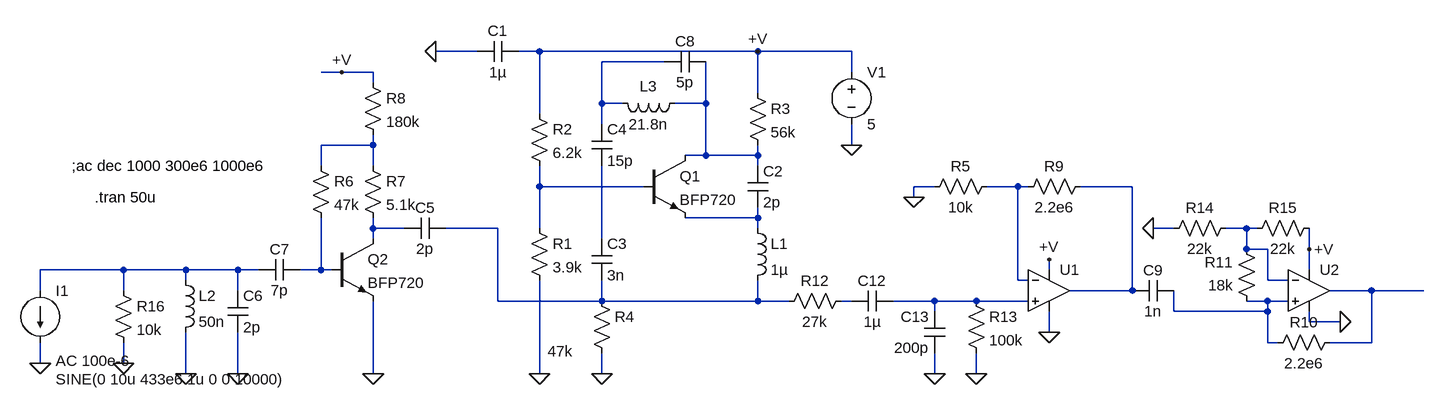
[diagram p0: schematic xy-mk-5v.asc]
xy-mk-5v.asc, the LTspice schematic file:
Version 4
SHEET 1 880 680
WIRE -832 -176 -896 -176
WIRE -736 -176 -768 -176
WIRE -400 -176 -736 -176
WIRE -256 -176 -400 -176
WIRE -544 -160 -640 -160
WIRE -1040 -144 -1072 -144
WIRE -992 -144 -1040 -144
WIRE -256 -144 -256 -176
WIRE -992 -128 -992 -144
WIRE -400 -112 -400 -176
WIRE -640 -96 -640 -160
WIRE -608 -96 -640 -96
WIRE -480 -96 -480 -160
WIRE -480 -96 -528 -96
WIRE -736 -80 -736 -176
WIRE -640 -64 -640 -96
WIRE -992 -32 -992 -48
WIRE -992 -32 -1072 -32
WIRE -256 -32 -256 -64
WIRE -480 -16 -480 -96
WIRE -480 -16 -512 -16
WIRE -400 -16 -400 -32
WIRE -400 -16 -480 -16
WIRE -1072 0 -1072 -32
WIRE -992 0 -992 -32
WIRE -400 0 -400 -16
WIRE -736 32 -736 0
WIRE -576 32 -736 32
WIRE -128 32 -160 32
WIRE 0 32 -48 32
WIRE 16 32 0 32
WIRE 176 32 96 32
WIRE -160 48 -160 32
WIRE -400 80 -400 64
WIRE -400 80 -512 80
WIRE -992 96 -992 80
WIRE -944 96 -992 96
WIRE -800 96 -880 96
WIRE -736 96 -736 32
WIRE -400 96 -400 80
WIRE 240 96 208 96
WIRE 352 96 320 96
WIRE 368 96 352 96
WIRE -992 112 -992 96
WIRE -640 112 -640 0
WIRE 352 128 352 96
WIRE 384 128 352 128
WIRE 448 128 448 96
WIRE -1376 160 -1504 160
WIRE -1280 160 -1376 160
WIRE -1200 160 -1280 160
WIRE -1168 160 -1200 160
WIRE -1072 160 -1072 80
WIRE -1072 160 -1104 160
WIRE -1056 160 -1072 160
WIRE 48 160 48 144
WIRE 448 160 448 128
WIRE -1280 176 -1280 160
WIRE 0 176 0 32
WIRE 16 176 0 176
WIRE 384 176 384 128
WIRE 416 176 384 176
WIRE -1504 192 -1504 160
WIRE -1376 192 -1376 160
WIRE -1200 192 -1200 160
WIRE 176 192 176 32
WIRE 176 192 80 192
WIRE 544 192 480 192
WIRE 624 192 544 192
WIRE -800 208 -800 96
WIRE -640 208 -640 176
WIRE -640 208 -800 208
WIRE -400 208 -400 176
WIRE -400 208 -640 208
WIRE -352 208 -400 208
WIRE -256 208 -272 208
WIRE -128 208 -192 208
WIRE -64 208 -128 208
WIRE 16 208 -64 208
WIRE 384 208 352 208
WIRE 416 208 384 208
WIRE -128 224 -128 208
WIRE 240 224 240 192
WIRE 384 224 384 208
WIRE 384 224 240 224
WIRE 448 240 448 224
WIRE 496 240 448 240
WIRE 48 256 48 224
WIRE 384 272 384 224
WIRE 400 272 384 272
WIRE 544 272 544 192
WIRE 544 272 480 272
WIRE -1504 304 -1504 272
WIRE -1376 304 -1376 272
WIRE -1280 320 -1280 256
WIRE -1200 320 -1200 256
WIRE -992 320 -992 208
WIRE -736 320 -736 176
WIRE -640 320 -640 288
WIRE -128 320 -128 288
WIRE -64 320 -64 288
FLAG -736 320 0
FLAG -400 -176 +V
FLAG -640 320 0
FLAG -256 -32 0
FLAG -1504 304 0
FLAG -992 320 0
FLAG -1200 320 0
FLAG -1280 320 0
FLAG -1040 -144 +V
FLAG -896 -176 0
FLAG -128 320 0
FLAG -64 320 0
FLAG -160 48 0
FLAG 48 256 0
FLAG 48 144 +V
FLAG 208 96 0
FLAG 496 240 0
FLAG 448 128 +V
FLAG -1376 304 0
SYMBOL npn -576 -16 R0
SYMATTR InstName Q1
SYMATTR Value BFP720
SYMBOL res -752 80 R0
SYMATTR InstName R1
SYMATTR Value 3.9k
SYMBOL res -752 -96 R0
SYMATTR InstName R2
SYMATTR Value 6.2k
SYMBOL cap -768 -192 R90
WINDOW 0 0 32 VBottom 2
WINDOW 3 32 32 VTop 2
SYMATTR InstName C1
SYMATTR Value 1µ
SYMBOL res -416 -128 R0
SYMATTR InstName R3
SYMATTR Value 56k
SYMBOL cap -416 0 R0
SYMATTR InstName C2
SYMATTR Value 2p
SYMBOL ind -416 80 R0
SYMATTR InstName L1
SYMATTR Value 1µ
SYMBOL res -656 192 R0
WINDOW 3 -67 93 Left 2
SYMATTR InstName R4
SYMATTR Value 47k
SYMBOL voltage -256 -160 R0
WINDOW 123 0 0 Left 2
WINDOW 39 0 0 Left 2
SYMATTR InstName V1
SYMATTR Value 5
SYMBOL current -1504 192 R0
WINDOW 3 24 136 Left 2
WINDOW 123 24 108 Left 2
WINDOW 39 0 0 Left 2
SYMATTR InstName I1
SYMATTR Value SINE(0 10u 433e6 1u 0 0 10000)
SYMATTR Value2 AC 100e-6
SYMBOL cap -880 80 R90
WINDOW 0 0 32 VBottom 2
WINDOW 3 32 32 VTop 2
SYMATTR InstName C5
SYMATTR Value 2p
SYMBOL cap -656 112 R0
SYMATTR InstName C3
SYMATTR Value 3n
SYMBOL ind -1296 160 R0
SYMATTR InstName L2
SYMATTR Value 50n
SYMBOL cap -1216 192 R0
SYMATTR InstName C6
SYMATTR Value 2p
SYMBOL cap -1104 144 R90
WINDOW 0 0 32 VBottom 2
WINDOW 3 32 32 VTop 2
SYMATTR InstName C7
SYMATTR Value 7p
SYMBOL npn -1056 112 R0
SYMATTR InstName Q2
SYMATTR Value BFP720
SYMBOL res -1088 -16 R0
SYMATTR InstName R6
SYMATTR Value 47k
SYMBOL res -1008 -16 R0
SYMATTR InstName R7
SYMATTR Value 5.1k
SYMBOL res -1008 -144 R0
SYMATTR InstName R8
SYMATTR Value 180k
SYMBOL ind -512 -112 R90
WINDOW 0 5 56 VBottom 2
WINDOW 3 32 56 VTop 2
SYMATTR InstName L3
SYMATTR Value 21.8n
SYMBOL cap -656 -64 R0
SYMATTR InstName C4
SYMATTR Value 15p
SYMBOL cap -480 -176 R90
WINDOW 0 0 32 VBottom 2
WINDOW 3 32 32 VTop 2
SYMATTR InstName C8
SYMATTR Value 5p
SYMBOL res -256 192 R90
WINDOW 0 0 56 VBottom 2
WINDOW 3 32 56 VTop 2
SYMATTR InstName R12
SYMATTR Value 27k
SYMBOL cap -192 192 R90
WINDOW 0 0 32 VBottom 2
WINDOW 3 32 32 VTop 2
SYMATTR InstName C12
SYMATTR Value 1µ
SYMBOL cap -112 288 R180
WINDOW 0 24 56 Left 2
WINDOW 3 24 8 Left 2
SYMATTR InstName C13
SYMATTR Value 200p
SYMBOL res -80 192 R0
SYMATTR InstName R13
SYMATTR Value 100k
SYMBOL res -32 16 R90
WINDOW 0 0 56 VBottom 2
WINDOW 3 32 56 VTop 2
SYMATTR InstName R5
SYMATTR Value 10k
SYMBOL res 112 16 R90
WINDOW 0 0 56 VBottom 2
WINDOW 3 32 56 VTop 2
SYMATTR InstName R9
SYMATTR Value 2.2e6
SYMBOL res 496 256 R90
WINDOW 0 0 56 VBottom 2
WINDOW 3 32 56 VTop 2
SYMATTR InstName R10
SYMATTR Value 2.2e6
SYMBOL res 368 224 R180
WINDOW 0 36 76 Left 2
WINDOW 3 36 40 Left 2
SYMATTR InstName R11
SYMATTR Value 18k
SYMBOL res 224 112 R270
WINDOW 0 32 56 VTop 2
WINDOW 3 0 56 VBottom 2
SYMATTR InstName R14
SYMATTR Value 22k
SYMBOL res 352 112 R270
WINDOW 0 32 56 VTop 2
WINDOW 3 0 56 VBottom 2
SYMATTR InstName R15
SYMATTR Value 22k
SYMBOL cap 240 176 R90
WINDOW 0 0 32 VBottom 2
WINDOW 3 32 32 VTop 2
SYMATTR InstName C9
SYMATTR Value 1n
SYMBOL Opamps\\UniversalOpamp2 48 192 R0
SYMATTR InstName U1
SYMBOL Opamps\\UniversalOpamp2 448 192 R0
SYMATTR InstName U2
SYMBOL res -1392 176 R0
SYMATTR InstName R16
SYMATTR Value 10k
TEXT -1420 48 Left 2 !.tran 50u
TEXT -1456 0 Left 2 !;ac dec 1000 300e6 1000e6

The netlist it stands for:
* xy-mk-5v.asc
Q1 N002 N004 N007 0 BFP720
R1 N004 0 3.9k
R2 +V N004 6.2k
C1 +V 0 1µ
R3 +V N002 56k
C2 N002 N007 2p
L1 N007 N009 1µ
R4 N009 0 47k
V1 +V 0 5
I1 N012 0 SINE(0 10u 433e6 1u 0 0 10000) AC 100e-6
C5 N009 N008 2p
C3 N011 N009 3n
L2 N012 0 50n
C6 N012 0 2p
C7 N013 N012 7p
Q2 N008 N013 0 0 BFP720
R6 N003 N013 47k
R7 N003 N008 5.1k
R8 +V N003 180k
L3 N002 N001 21.8n
C4 N001 N011 15p
C8 N002 N001 5p
R12 N015 N009 27k
C12 N016 N015 1µ
C13 0 N016 200p
R13 N016 0 100k
R5 N005 0 10k
R9 N006 N005 2.2e6
R10 N014 N017 2.2e6
R11 N017 N010 18k
R14 0 N010 22k
R15 N010 +V 22k
C9 N017 N006 1n
XU1 N016 N005 +V 0 N006 level.2 Avol=1Meg GBW=10Meg Slew=10Meg ilimit=25m rail=0 Vos=0 phimargin=45 en=0 enk=0 in=0 ink=0 Rin=500Meg  ; pins IN+ IN- V+ V- OUT
XU2 N017 N010 +V 0 N014 level.2 Avol=1Meg GBW=10Meg Slew=10Meg ilimit=25m rail=0 Vos=0 phimargin=45 en=0 enk=0 in=0 ink=0 Rin=500Meg  ; pins IN+ IN- V+ V- OUT
R16 N012 0 10k
.model NPN NPN
.model PNP PNP
.lib standard.bjt
.tran 50u
;ac dec 1000 300e6 1000e6
.lib UniversalOpamps2.sub
.backanno
.end